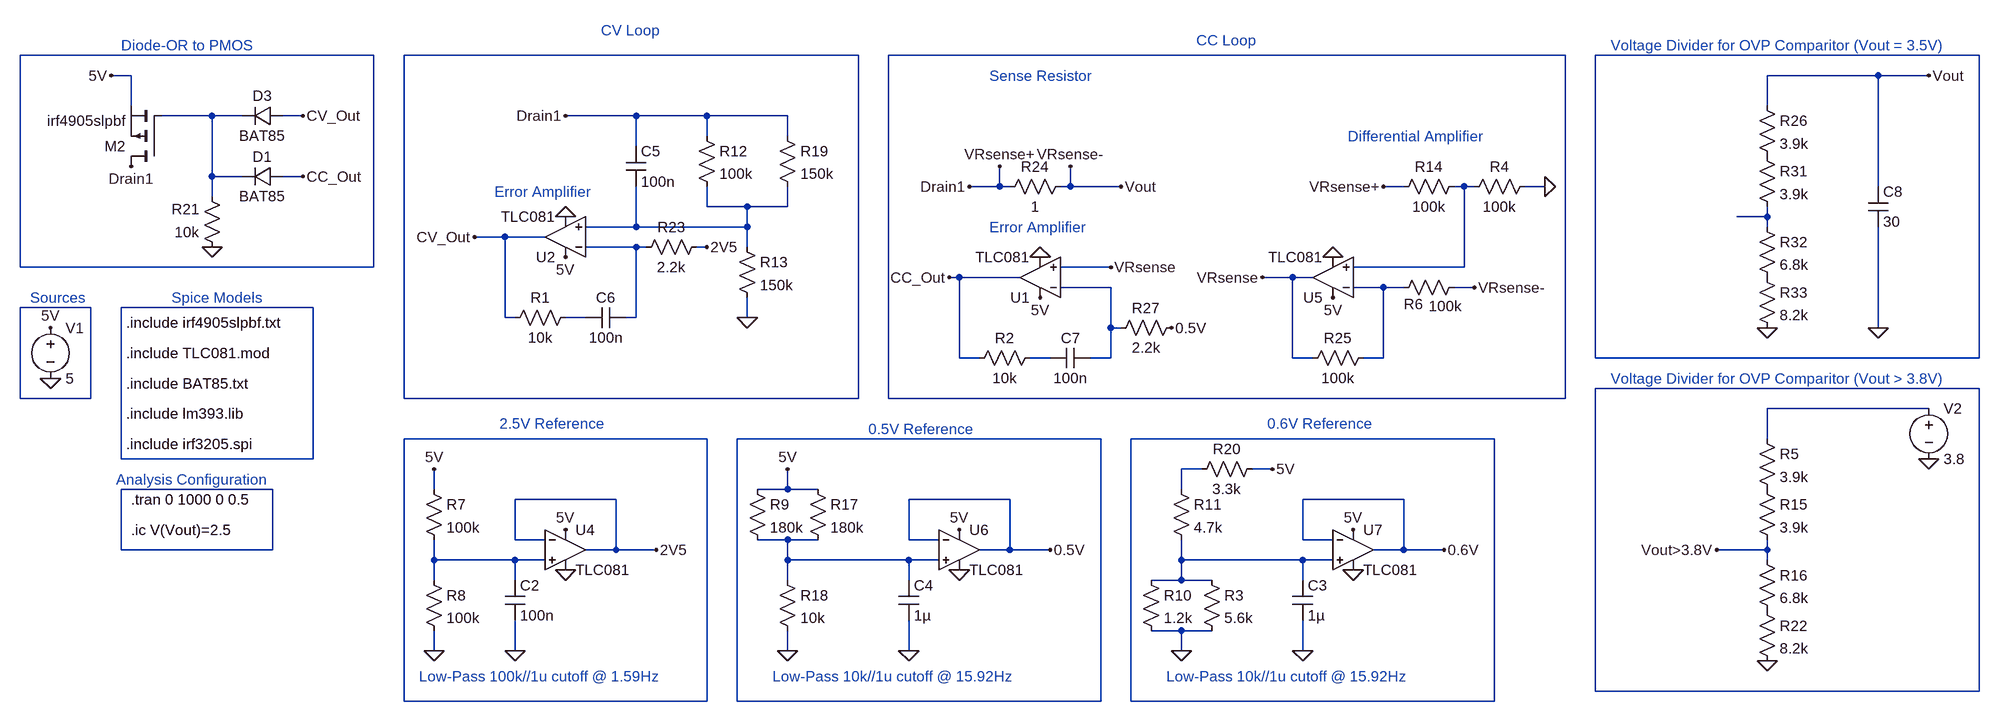
[diagram p0: schematic Charger.asc]
Charger.asc, the LTspice schematic file:
Version 4.1
SHEET 1 4772 2228
WIRE 1264 496 704 496
WIRE 2032 496 1312 496
WIRE 3152 496 2080 496
WIRE 3808 496 3200 496
WIRE 880 528 848 528
WIRE 3648 528 3472 528
WIRE 3728 528 3648 528
WIRE 880 576 880 528
WIRE 3472 576 3472 528
WIRE 1008 592 928 592
WIRE 1056 592 1008 592
WIRE 1152 592 1120 592
WIRE 1680 592 1568 592
WIRE 1792 592 1680 592
WIRE 1920 592 1792 592
WIRE 1792 624 1792 592
WIRE 1920 624 1920 592
WIRE 1680 640 1680 592
WIRE 1008 688 1008 592
WIRE 1056 688 1008 688
WIRE 1152 688 1120 688
WIRE 2256 704 2256 672
WIRE 2256 704 2208 704
WIRE 2272 704 2256 704
WIRE 2368 704 2368 672
WIRE 2368 704 2352 704
WIRE 2448 704 2368 704
WIRE 2896 704 2864 704
WIRE 2992 704 2976 704
WIRE 3008 704 2992 704
WIRE 3120 704 3088 704
WIRE 3648 704 3648 528
WIRE 1008 720 1008 688
WIRE 1792 736 1792 704
WIRE 1856 736 1792 736
WIRE 1920 736 1920 704
WIRE 1920 736 1856 736
WIRE 3472 752 3472 736
WIRE 3472 752 3424 752
WIRE 1680 768 1680 704
WIRE 1680 768 1600 768
WIRE 1856 768 1856 736
WIRE 1856 768 1680 768
WIRE 3472 768 3472 752
WIRE 1472 784 1424 784
WIRE 1536 784 1472 784
WIRE 1680 800 1600 800
WIRE 1696 800 1680 800
WIRE 1792 800 1776 800
WIRE 1856 800 1856 768
WIRE 704 832 704 496
WIRE 1264 832 1264 496
WIRE 1264 832 704 832
WIRE 2432 832 2352 832
WIRE 2992 832 2992 704
WIRE 2992 832 2816 832
WIRE 2192 848 2176 848
WIRE 2288 848 2192 848
WIRE 2720 848 2672 848
WIRE 2752 848 2720 848
WIRE 2432 864 2352 864
WIRE 2864 864 2816 864
WIRE 2896 864 2864 864
WIRE 3008 864 2976 864
WIRE 816 896 704 896
WIRE 1168 896 864 896
WIRE 1472 912 1472 784
WIRE 1488 912 1472 912
WIRE 1600 912 1568 912
WIRE 1680 912 1680 800
WIRE 1680 912 1664 912
WIRE 1856 912 1856 880
WIRE 2432 928 2432 864
WIRE 2448 928 2432 928
WIRE 3648 928 3648 768
WIRE 2192 976 2192 848
WIRE 2224 976 2192 976
WIRE 2336 976 2304 976
WIRE 2432 976 2432 928
WIRE 2432 976 2400 976
WIRE 2720 976 2720 848
WIRE 2752 976 2720 976
WIRE 2864 976 2864 864
WIRE 2864 976 2832 976
WIRE 3200 976 3200 496
WIRE 3808 976 3808 496
WIRE 3808 976 3200 976
WIRE 3808 1024 3200 1024
WIRE 704 1040 704 896
WIRE 816 1040 816 896
WIRE 816 1040 704 1040
WIRE 1312 1040 1312 496
WIRE 2032 1040 2032 496
WIRE 2032 1040 1312 1040
WIRE 2080 1040 2080 496
WIRE 3152 1040 3152 496
WIRE 3152 1040 2080 1040
WIRE 3728 1056 3472 1056
WIRE 1792 1104 1312 1104
WIRE 2416 1104 1840 1104
WIRE 3040 1104 2464 1104
WIRE 3472 1104 3472 1056
WIRE 864 1136 864 896
WIRE 1168 1136 1168 896
WIRE 1168 1136 864 1136
WIRE 2576 1152 2544 1152
WIRE 2688 1152 2656 1152
WIRE 1104 1184 864 1184
WIRE 1360 1184 1360 1152
WIRE 1920 1184 1920 1152
WIRE 1920 1184 1872 1184
WIRE 1968 1184 1920 1184
WIRE 2544 1184 2544 1152
WIRE 1648 1200 1488 1200
WIRE 2272 1200 2112 1200
WIRE 2896 1200 2736 1200
WIRE 1488 1264 1488 1200
WIRE 1536 1264 1488 1264
WIRE 1920 1264 1872 1264
WIRE 1968 1264 1920 1264
WIRE 2112 1264 2112 1200
WIRE 2160 1264 2112 1264
WIRE 2736 1264 2736 1200
WIRE 2784 1264 2736 1264
WIRE 864 1280 864 1184
WIRE 1104 1280 1104 1184
WIRE 1104 1280 864 1280
WIRE 1648 1280 1648 1200
WIRE 1648 1280 1600 1280
WIRE 1712 1280 1648 1280
WIRE 2272 1280 2272 1200
WIRE 2272 1280 2224 1280
WIRE 2336 1280 2272 1280
WIRE 2896 1280 2896 1200
WIRE 2896 1280 2848 1280
WIRE 2960 1280 2896 1280
WIRE 3472 1280 3472 1264
WIRE 3472 1280 3392 1280
WIRE 1360 1296 1360 1264
WIRE 1488 1296 1360 1296
WIRE 1536 1296 1488 1296
WIRE 1920 1296 1920 1264
WIRE 2112 1296 1920 1296
WIRE 2160 1296 2112 1296
WIRE 2544 1296 2544 1264
WIRE 2736 1296 2544 1296
WIRE 2784 1296 2736 1296
WIRE 3472 1296 3472 1280
WIRE 1360 1328 1360 1296
WIRE 1488 1328 1488 1296
WIRE 1920 1328 1920 1296
WIRE 2112 1328 2112 1296
WIRE 2544 1328 2544 1296
WIRE 2544 1328 2496 1328
WIRE 2592 1328 2544 1328
WIRE 2736 1328 2736 1296
WIRE 2544 1408 2496 1408
WIRE 2592 1408 2544 1408
WIRE 1360 1440 1360 1408
WIRE 1488 1440 1488 1392
WIRE 1920 1440 1920 1408
WIRE 2112 1440 2112 1392
WIRE 2544 1440 2544 1408
WIRE 2736 1440 2736 1392
WIRE 3200 1504 3200 1024
WIRE 3808 1504 3808 1024
WIRE 3808 1504 3200 1504
WIRE 1312 1520 1312 1104
WIRE 1792 1520 1792 1104
WIRE 1792 1520 1312 1520
WIRE 1840 1520 1840 1104
WIRE 2416 1520 2416 1104
WIRE 2416 1520 1840 1520
WIRE 2464 1520 2464 1104
WIRE 3040 1520 3040 1104
WIRE 3040 1520 2464 1520
FLAG 752 1008 0
FLAG 752 928 5V
FLAG 1792 800 2V5
FLAG 1856 912 0
FLAG 880 672 Drain1
FLAG 848 528 5V
FLAG 1568 816 5V
FLAG 1568 752 0
FLAG 2320 880 5V
FLAG 2320 816 0
FLAG 2528 928 0.5V
FLAG 1360 1152 5V
FLAG 1360 1440 0
FLAG 1488 1440 0
FLAG 1712 1280 2V5
FLAG 1568 1248 5V
FLAG 1568 1312 0
FLAG 1920 1152 5V
FLAG 1920 1440 0
FLAG 2112 1440 0
FLAG 2336 1280 0.5V
FLAG 2192 1248 5V
FLAG 2192 1312 0
FLAG 2544 1440 0
FLAG 2736 1440 0
FLAG 2816 1248 5V
FLAG 2816 1312 0
FLAG 2960 1280 0.6V
FLAG 2688 1152 5V
FLAG 1568 592 Drain1
FLAG 1424 784 CV_Out
FLAG 2176 848 CC_Out
FLAG 1152 688 CC_Out
FLAG 1152 592 CV_Out
FLAG 1008 800 0
FLAG 2784 880 5V
FLAG 2784 816 0
FLAG 3648 928 0
FLAG 2448 704 Vout
FLAG 2208 704 Drain1
FLAG 3472 928 0
FLAG 2672 848 VRsense
FLAG 2432 832 VRsense
FLAG 3728 528 Vout
FLAG 2256 672 VRsense+
FLAG 2368 672 VRsense-
FLAG 3008 864 VRsense-
FLAG 3120 704 0
FLAG 2864 704 VRsense+
FLAG 3472 1456 0
FLAG 3728 1136 0
FLAG 3392 1280 Vout>3.8V
SYMBOL voltage 752 912 R0
WINDOW 123 0 0 Left 0
WINDOW 39 0 0 Left 0
SYMATTR InstName V1
SYMATTR Value 5
SYMBOL res 1840 784 R0
SYMATTR InstName R13
SYMATTR Value 150k
SYMBOL pmos 928 672 R180
SYMATTR InstName M2
SYMATTR Value irf4905slpbf
SYMATTR Prefix X
SYMBOL res 2320 960 R90
WINDOW 0 0 56 VBottom 2
WINDOW 3 32 56 VTop 2
SYMATTR InstName R2
SYMATTR Value 10k
SYMBOL diode 1120 576 R90
WINDOW 0 0 32 VBottom 2
WINDOW 3 32 32 VTop 2
SYMATTR InstName D3
SYMATTR Value BAT85
SYMATTR Prefix X
SYMBOL OpAmps\\opamp2 1568 848 R180
SYMATTR InstName U2
SYMATTR Value TLC081
SYMBOL OpAmps\\opamp2 2320 912 R180
SYMATTR InstName U1
SYMATTR Value TLC081
SYMBOL OpAmps\\opamp2 1568 1216 R0
SYMATTR InstName U4
SYMATTR Value TLC081
SYMBOL res 1344 1168 R0
SYMATTR InstName R7
SYMATTR Value 100k
SYMBOL res 1344 1312 R0
SYMATTR InstName R8
SYMATTR Value 100k
SYMBOL cap 1472 1328 R0
SYMATTR InstName C2
SYMATTR Value 100n
SYMBOL OpAmps\\opamp2 2192 1216 R0
SYMATTR InstName U6
SYMATTR Value TLC081
SYMBOL cap 2096 1328 R0
SYMATTR InstName C4
SYMATTR Value 1µ
SYMBOL res 1856 1168 R0
SYMATTR InstName R9
SYMATTR Value 180k
SYMBOL res 1952 1168 R0
SYMATTR InstName R17
SYMATTR Value 180k
SYMBOL res 1904 1312 R0
SYMATTR InstName R18
SYMATTR Value 10k
SYMBOL res 1776 608 R0
SYMATTR InstName R12
SYMATTR Value 100k
SYMBOL res 1904 608 R0
SYMATTR InstName R19
SYMATTR Value 150k
SYMBOL diode 1120 672 R90
WINDOW 0 0 32 VBottom 2
WINDOW 3 32 32 VTop 2
SYMATTR InstName D1
SYMATTR Value BAT85
SYMATTR Prefix X
SYMBOL OpAmps\\opamp2 2816 1216 R0
SYMATTR InstName U7
SYMATTR Value TLC081
SYMBOL cap 2720 1328 R0
SYMATTR InstName C3
SYMATTR Value 1µ
SYMBOL res 2576 1312 R0
SYMATTR InstName R3
SYMATTR Value 5.6k
SYMBOL res 2480 1312 R0
SYMATTR InstName R10
SYMATTR Value 1.2k
SYMBOL res 2528 1168 R0
SYMATTR InstName R11
SYMATTR Value 4.7k
SYMBOL res 2672 1136 R90
WINDOW 0 0 56 VBottom 2
WINDOW 3 32 56 VTop 2
SYMATTR InstName R20
SYMATTR Value 3.3k
SYMBOL res 1584 896 R90
WINDOW 0 0 56 VBottom 2
WINDOW 3 32 56 VTop 2
SYMATTR InstName R1
SYMATTR Value 10k
SYMBOL cap 1664 640 R0
SYMATTR InstName C5
SYMATTR Value 100n
SYMBOL cap 1664 896 R90
WINDOW 0 0 32 VBottom 2
WINDOW 3 32 32 VTop 2
SYMATTR InstName C6
SYMATTR Value 100n
SYMBOL res 1024 816 R180
WINDOW 0 36 76 Left 2
WINDOW 3 36 40 Left 2
SYMATTR InstName R21
SYMATTR Value 10k
SYMBOL cap 2400 960 R90
WINDOW 0 0 32 VBottom 2
WINDOW 3 32 32 VTop 2
SYMATTR InstName C7
SYMATTR Value 100n
SYMBOL res 2368 688 R90
WINDOW 0 0 56 VBottom 2
WINDOW 3 32 56 VTop 2
SYMATTR InstName R24
SYMATTR Value 1
SYMBOL res 2848 960 R90
WINDOW 0 0 56 VBottom 2
WINDOW 3 32 56 VTop 2
SYMATTR InstName R25
SYMATTR Value 100k
SYMBOL OpAmps\\opamp2 2784 912 R180
SYMATTR InstName U5
SYMATTR Value TLC081
SYMBOL cap 3632 704 R0
SYMATTR InstName C8
SYMATTR Value 30
SYMBOL res 3456 560 R0
SYMATTR InstName R26
SYMATTR Value 3.9k
SYMBOL res 3456 640 R0
SYMATTR InstName R31
SYMATTR Value 3.9k
SYMBOL res 3456 752 R0
SYMATTR InstName R32
SYMATTR Value 6.8k
SYMBOL res 3456 832 R0
SYMATTR InstName R33
SYMATTR Value 8.2k
SYMBOL res 2992 848 R90
WINDOW 0 58 80 VBottom 2
WINDOW 3 30 30 VTop 2
SYMATTR InstName R6
SYMATTR Value 100k
SYMBOL res 2992 720 R270
WINDOW 0 32 56 VTop 2
WINDOW 3 0 56 VBottom 2
SYMATTR InstName R4
SYMATTR Value 100k
SYMBOL res 2880 720 R270
WINDOW 0 32 56 VTop 2
WINDOW 3 0 56 VBottom 2
SYMATTR InstName R14
SYMATTR Value 100k
SYMBOL res 3456 1088 R0
SYMATTR InstName R5
SYMATTR Value 3.9k
SYMBOL res 3456 1168 R0
SYMATTR InstName R15
SYMATTR Value 3.9k
SYMBOL res 3456 1280 R0
SYMATTR InstName R16
SYMATTR Value 6.8k
SYMBOL res 3456 1360 R0
SYMATTR InstName R22
SYMATTR Value 8.2k
SYMBOL voltage 3728 1040 R0
WINDOW 123 0 0 Left 0
WINDOW 39 0 0 Left 0
SYMATTR InstName V2
SYMATTR Value 3.8
SYMBOL res 1792 784 R90
WINDOW 0 0 56 VBottom 2
WINDOW 3 32 56 VTop 2
SYMATTR InstName R23
SYMATTR Value 2.2k
SYMBOL res 2544 912 R90
WINDOW 0 0 56 VBottom 2
WINDOW 3 32 56 VTop 2
SYMATTR InstName R27
SYMATTR Value 2.2k
TEXT 880 1200 Left 2 !.tran 0 1000 0 0.5
TEXT 880 1248 Left 2 !.ic V(Vout)=2.5
TEXT 872 920 Left 2 !.include irf4905slpbf.txt
TEXT 872 968 Left 2 !.include TLC081.mod
TEXT 872 1016 Left 2 !.include BAT85.txt
TEXT 1336 1480 Left 2 ;Low-Pass 100k//1u cutoff @ 1.59Hz
TEXT 1896 1480 Left 2 ;Low-Pass 10k//1u cutoff @ 15.92Hz
TEXT 1464 1080 Left 2 ;2.5V Reference
TEXT 2048 1088 Left 2 ;0.5V Reference
TEXT 2520 1480 Left 2 ;Low-Pass 10k//1u cutoff @ 15.92Hz
TEXT 2680 1080 Left 2 ;0.6V Reference
TEXT 872 1064 Left 2 !.include lm393.lib
TEXT 872 1112 Left 2 !.include irf3205.spi
TEXT 864 480 Left 2 ;Diode-OR to PMOS
TEXT 1624 456 Left 2 ;CV Loop
TEXT 2240 528 Left 2 ;Sense Resistor
TEXT 2568 472 Left 2 ;CC Loop
TEXT 944 880 Left 2 ;Spice Models
TEXT 720 880 Left 2 ;Sources
TEXT 3224 480 Left 2 ;Voltage Divider for OVP Comparitor (Vout = 3.5V)
TEXT 2808 624 Left 2 ;Differential Amplifier
TEXT 2240 768 Left 2 ;Error Amplifier
TEXT 1456 712 Left 2 ;Error Amplifier
TEXT 856 1168 Left 2 ;Analysis Configuration
TEXT 3224 1008 Left 2 ;Voltage Divider for OVP Comparitor (Vout > 3.8V)

The netlist it stands for:
* Charger.asc
V1 5V 0 5
R13 N007 0 150k
X§M2 VRsense+ N005 5V irf4905slpbf  ; pins D G S
R2 N015 CC_Out 10k
X§D3 CV_Out N005 BAT85  ; pins + -
X§U2 N007 N009 5V 0 CV_Out TLC081  ; pins In+ In- V+ V- OUT
X§U1 VRsense N010 5V 0 CC_Out TLC081  ; pins In+ In- V+ V- OUT
X§U4 N024 2V5 5V 0 2V5 TLC081  ; pins In+ In- V+ V- OUT
R7 5V N024 100k
R8 N024 0 100k
C2 N024 0 100n
X§U6 N023 0.5V 5V 0 0.5V TLC081  ; pins In+ In- V+ V- OUT
C4 N023 0 1µ
R9 5V N023 180k
R17 5V N023 180k
R18 N023 0 10k
R12 VRsense+ N007 100k
R19 VRsense+ N007 150k
X§D1 CC_Out N005 BAT85  ; pins + -
X§U7 N025 0.6V 5V 0 0.6V TLC081  ; pins In+ In- V+ V- OUT
C3 N025 0 1µ
R3 N025 0 5.6k
R10 N025 0 1.2k
R11 N021 N025 4.7k
R20 5V N021 3.3k
R1 N014 CV_Out 10k
C5 VRsense+ N007 100n
C6 N009 N014 100n
R21 0 N005 10k
C7 N010 N015 100n
R24 VRsense- VRsense+ 1
R25 N011 VRsense 100k
X§U5 N006 N011 5V 0 VRsense TLC081  ; pins In+ In- V+ V- OUT
C8 VRsense- 0 30
R26 VRsense- P001 3.9k
R31 P001 N008 3.9k
R32 N008 P002 6.8k
R33 P002 0 8.2k
R6 VRsense- N011 100k
R4 N006 0 100k
R14 VRsense+ N006 100k
R5 N017 P003 3.9k
R15 P003 Vout>3.8V 3.9k
R16 Vout>3.8V P004 6.8k
R22 P004 0 8.2k
V2 N017 0 3.8
R23 2V5 N009 2.2k
R27 0.5V N010 2.2k
.tran 0 1000 0 0.5
.ic V(Vout)=2.5
.include irf4905slpbf.txt
.include TLC081.mod
.include BAT85.txt
* Low-Pass 100k//1u cutoff @ 1.59Hz
* Low-Pass 10k//1u cutoff @ 15.92Hz
* 2.5V Reference
* 0.5V Reference
* Low-Pass 10k//1u cutoff @ 15.92Hz
* 0.6V Reference
.include lm393.lib
.include irf3205.spi
* Diode-OR to PMOS
* CV Loop
* Sense Resistor
* CC Loop
* Spice Models
* Sources
* Voltage Divider for OVP Comparitor (Vout = 3.5V)
* Differential Amplifier
* Error Amplifier
* Error Amplifier
* Analysis Configuration
* Voltage Divider for OVP Comparitor (Vout > 3.8V)
.backanno
.end